# Altium schematic sheet Battery_Charger.SchDoc: Battery Charger
size A4; Author: zac1; DrawnBy: zac1; Engineer: zac1; Organization: Berne University of Applied Sciences; Address1: School of Engineering and; Address2: Information Technology; Address3: Quellgasse 21; Address4: CH-2501 Biel; Revision: 1.0; SheetNumber: 2; SheetTotal: 6
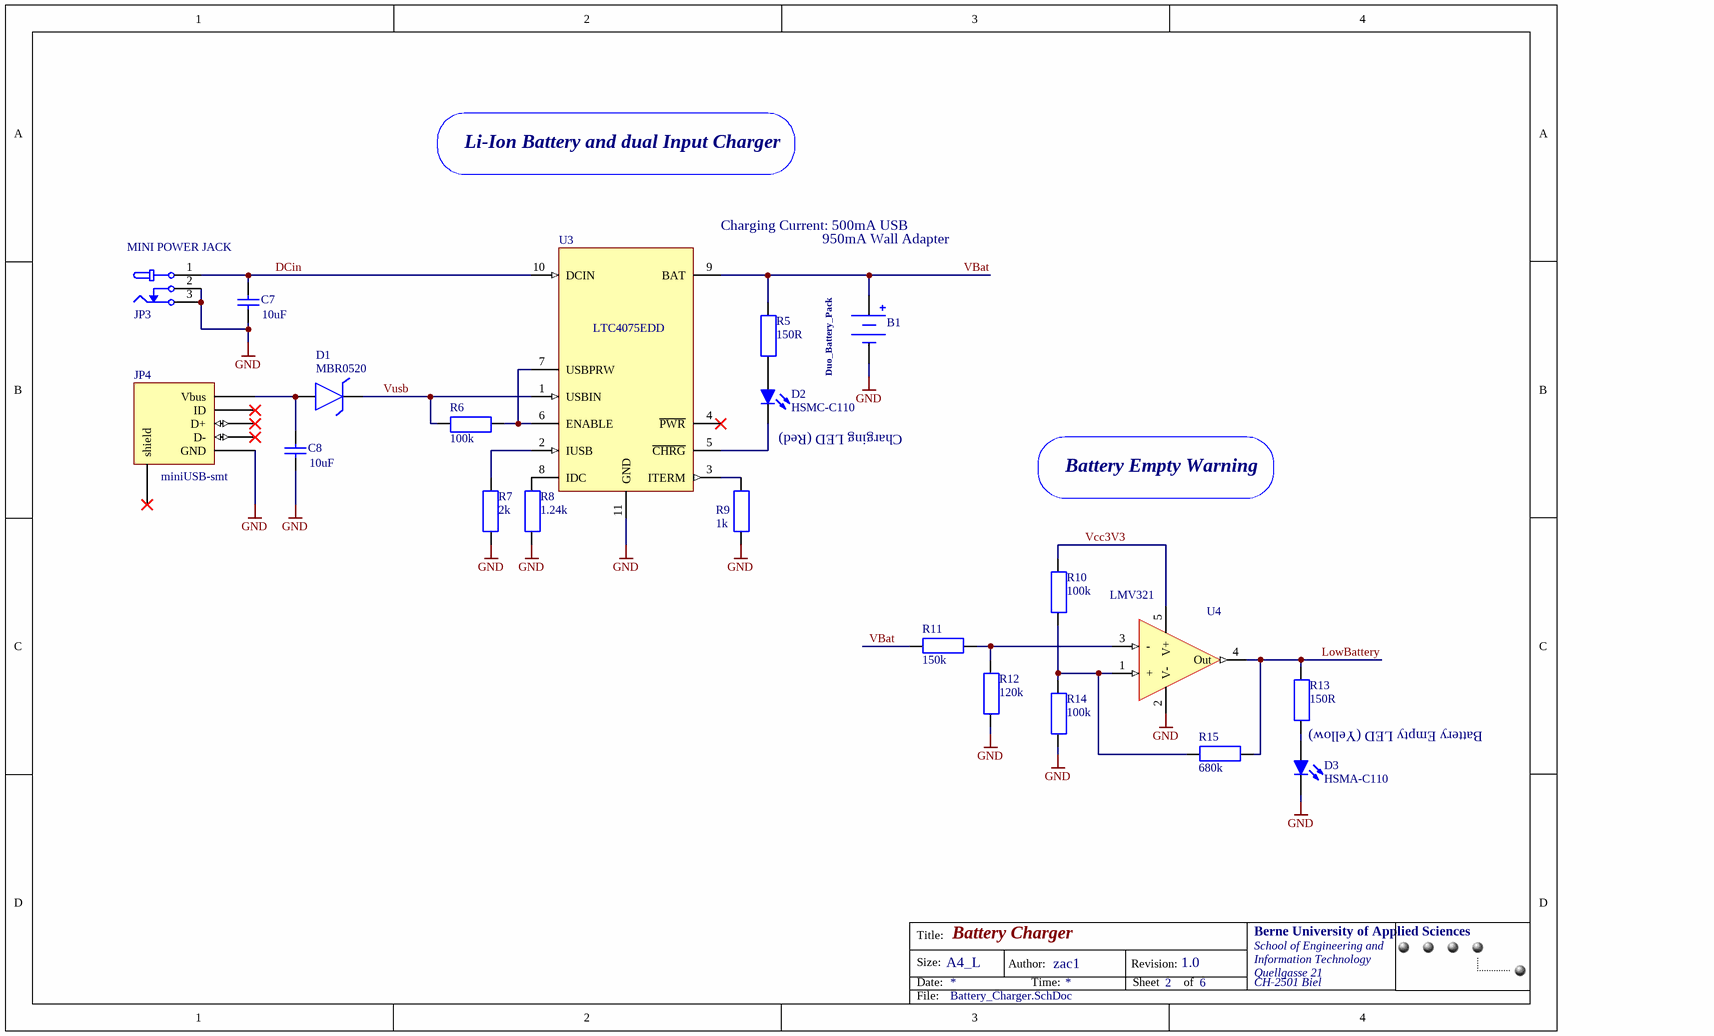
[diagram p0: Battery_Charger.SchDoc]

## Parts
B1  New_Battery  [Battery_new]  (value not drawn)
C7  value 10uF  [C1206]  (hidden comment: Cap Semi)
C8  value 10uF  [C1206]  (hidden comment: Cap Semi)
D1  MBR0520  [sod-123]
D2  HSMC-C110  [HSMC-C110]
D3  HSMA-C110  [HSMC-C110]
JP3  MINI POWER JACK  [Mini power Jack]
JP4  value miniUSB-smt  [USB_MINI_B_SMD]  (hidden comment: USB-MINIB-SMT)
R5  150R  [1608[0603]]
R6  100k  [1608[0603]]
R7  2k  [1608[0603]]
R8  1.24k  [1608[0603]]
R9  1k  [1608[0603]]
R10  100k  [1608[0603]]
R11  150k  [1608[0603]]
R12  120k  [1608[0603]]
R13  150R  [1608[0603]]
R14  100k  [1608[0603]]
R15  680k  [1608[0603]]
U3  LTC4075EDD  [LTC4075]
U4  LMV321  [LMV331]

## Nets
GND: B1.2(J2) C7.1 C8.1 D3.1(K) JP3.2(GND) JP3.3(GND) JP4.GND R7.2(J2) R8.1(J1) R9.1(J1) R12.1(J1) R14.1(J1) U3.11(GND) U4.2(V-)
DCin: C7.2 JP3.1(VDD) U3.10(DCIN)
LowBattery: R13.2(J2) R15.1(J1) U4.4(Out)
VBat: B1.1(J1) R5.2(J2) R11.2(J2) U3.9(BAT)
Vcc3V3: R10.2(J2) U4.5(V+)
Vusb: D1.1(Cathode) R6.1(J1) U3.1(USBIN)
NetC8_2: C8.2 D1.2(Anode) JP4.Vbus
NetD2_1: D2.1(K) U3.5(~{CHRG})
NetD2_2: D2.2(A) R5.1(J1)
NetD3_2: D3.2(A) R13.1(J1)
NetR6_2: R6.2(J2) U3.6(ENABLE) U3.7(USBPRW)
NetR7_1: R7.1(J1) U3.2(IUSB)
NetR8_2: R8.2(J2) U3.8(IDC)
NetR9_2: R9.2(J2) U3.3(ITERM)
NetR10_1: R10.1(J1) R14.2(J2) R15.2(J2) U4.1(+)
NetR11_1: R11.1(J1) R12.2(J2) U4.3(-)

Not connected (* = marked no-connect by the designer): JP4 D+* D-* ID* shield*; U3 4(~{PWR})*

## Notes on the sheet
- Li-Ion Battery and dual Input Charger
- (near U3) Charging Current: 500mA USB
- 950mA Wall Adapter
- (near B1) Duo_Battery_Pack
- (near D2) Charging LED (Red)
- Battery Empty Warning
- (near R13) Battery Empty LED (Yellow)
- Title:
- Size:
- Date:
- A4_L
- Author:
- Time:
- Revision:
- Sheet
- of
- File:

## Library data of the parts
B1 = BATTERY_NEW: Manufacturer: Contrel; Value: PA-LP987; Currency: CHF; lead time: 5 Weeks; Packaging unit: 1; Distributor: Contrel; Distributor Number: PA-LP987; Part Number: PA-LP987; RoHS: yes
C7 C8 = Cap Semi: Capacitor (Semiconductor SIM Model); Manufacturer: Murata; Part Number: GRM31CR70J106KA01L; Currency: CHF; Packaging unit: 1; Published: 8-Jun-2000; LatestRevisionDate: 17-Jul-2002; LatestRevisionNote: Re-released for DXP Platform.; Publisher: Altium Limited; Distributor: Farnell; Distributor Number: 9527 729; Price: 0.25; RoHS: yes
D1 = SCHOTTKY_MBR05*: Manufacturer: ON Semi; Part Number: MBR0520LT1G; Currency: CHF; Packaging unit: 1; Part Type: MBR0520; Value: MBR0520; Distributor: Farnell; Distributor Number: 9556 915; Price: 0.561; RoHS: yes
D2 = LED-HSM*-C110: LED; Manufacturer: Avago; Value: side led red; Currency: CHF; Packaging unit: 5; Revision: July-2002: Re-released for DXP Platform.; Part Type: HSMC-C110; Distributor: Farnell; Distributor Number: 8554 498; Part Number: HSMC-C110; Price: 0.288; RoHS: yes
D3 = LED-HSM*-C110: LED; Manufacturer: Avago; Value: side led yellow; Currency: CHF; Packaging unit: 5; Revision: July-2002: Re-released for DXP Platform.; Part Type: HSMA-C110; Distributor: Farnell; Distributor Number: 8554 455; Part Number: HSMA-C110; Price: 0.577; RoHS: yes
JP3 = MINI POWER JACK: Manufacturer: CLIFF ELECTRONIC; Value: DC8; Currency: CHF; Packaging unit: 10; Distributor: Farnell; Distributor Number: 224 947; Part Number: DC8; RoHS: yes; Price: 1.855
JP4 = USB-MINIB-SMT: Manufacturer: Lumberg; Part Number: 2486 01; Currency: CHF; Packaging unit: 1; Distributor: Farnell; Distributor Number: 1243 250; RoHS: yes; Price: 2.55
R5 R13 = RES: Resistance; Manufacturer: Multicomp; Part Number: MC 0.063W 0603 1% 150R; Value: 150R 0603; Currency: CHF; Packaging unit: 50; Part Type: 150R; Distributor: Farnell; Distributor Number: 9330 593; RoHS: X-yes; Price: 0.062
R6 R10 R14 = RES: Resistance; Manufacturer: Multicomp; Part Number: MC 0.063W 0603 1% 100K; Value: 100k 0603; Currency: CHF; Packaging unit: 50; Part Type: 100k; Distributor: Farnell; Distributor Number: 9330 402; RoHS: X-yes; Price: 0.062
R7 = RES: Resistance; Manufacturer: Multicomp; Part Number: MC 0.063W 0603 1% 2K; Value: 2k 0603; Currency: CHF; Packaging unit: 50; Part Type: 2k; Distributor: Farnell; Distributor Number: 9330 763; RoHS: X-yes; Price: 0.062
R8 = RES: Resistance; Manufacturer: Multicomp; Part Number: MC 0.063W 0603 1% 1M; Value: 1M 0603; Currency: CHF; Packaging unit: 50; Part Type: 1.24k; Distributor: Farnell; Distributor Number: 9330 410; RoHS: X-yes; Price: 0.062
R9 = RES: Resistance; Manufacturer: Multicomp; Part Number: MC 0.063W 0603 1% 1K; Value: 1k 0603; Currency: CHF; Packaging unit: 50; Part Type: 1k; Distributor: Farnell; Distributor Number: 9330 380; RoHS: X-yes; Price: 0.062
R11 = RES: Resistance; Manufacturer: Multicomp; Part Number: MC 0.063W 0603 1% 150K; Value: 150k 0603; Currency: CHF; Packaging unit: 50; Part Type: 150k; Distributor: Farnell; Distributor Number: 9330 623; RoHS: X-yes; Price: 0.034
R12 = RES: Resistance; Manufacturer: Multicomp; Part Number: MC 0.063W 0603 1% 120K; Value: 120k 0603; Currency: CHF; Packaging unit: 50; Part Type: 120k; Distributor: Farnell; Distributor Number: 9330 526; RoHS: X-yes; Price: 0.062
R15 = RES: Resistance; Manufacturer: Multicomp; Part Number: MC 0.063W 0603 1% 680K; Value: 680k 0603; Currency: CHF; Packaging unit: 50; Part Type: 680k; Distributor: Farnell; Distributor Number: 9331 476; RoHS: X-yes; Price: 0.062
U3 = LTC4075: Manufacturer: Linear; Part Number: LTC4075EDD#PBF; Currency: $; lead time: 2 Weeks; Packaging unit: 1; Value: LTC4075; Distributor: Linear online; Distributor Number: LTC4075EDD#PBF; RoHS: yes; Price: 2.67
U4 = LMV321: Op. Amp.; Manufacturer: TI; Value: LMV321IDBVR; Currency: CHF; Packaging unit: 1; Distributor: Farnell; Distributor Number: 1105 935; Part Number: LMV321IDBVR; RoHS: yes; Price: 0.863